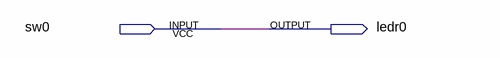
[diagram p0: schematic sheet]
// Quartus schematic cycloneii_sandbox.bdf as structural Verilog: 0 symbols, 2 pins
module cycloneii_sandbox (
  input  sw0,
  output ledr0
);


  assign ledr0 = sw0;
endmodule
